# EasyEDA schematic SCH_v0.4_2021-05-04.json

## Sheets
1 CPU CORE: TITLE: CPU Core; REV: 0.2; Date: 2020-07-01; Sheet: 1/3; Drawn By: Renee; Company: Lost Cat Productions
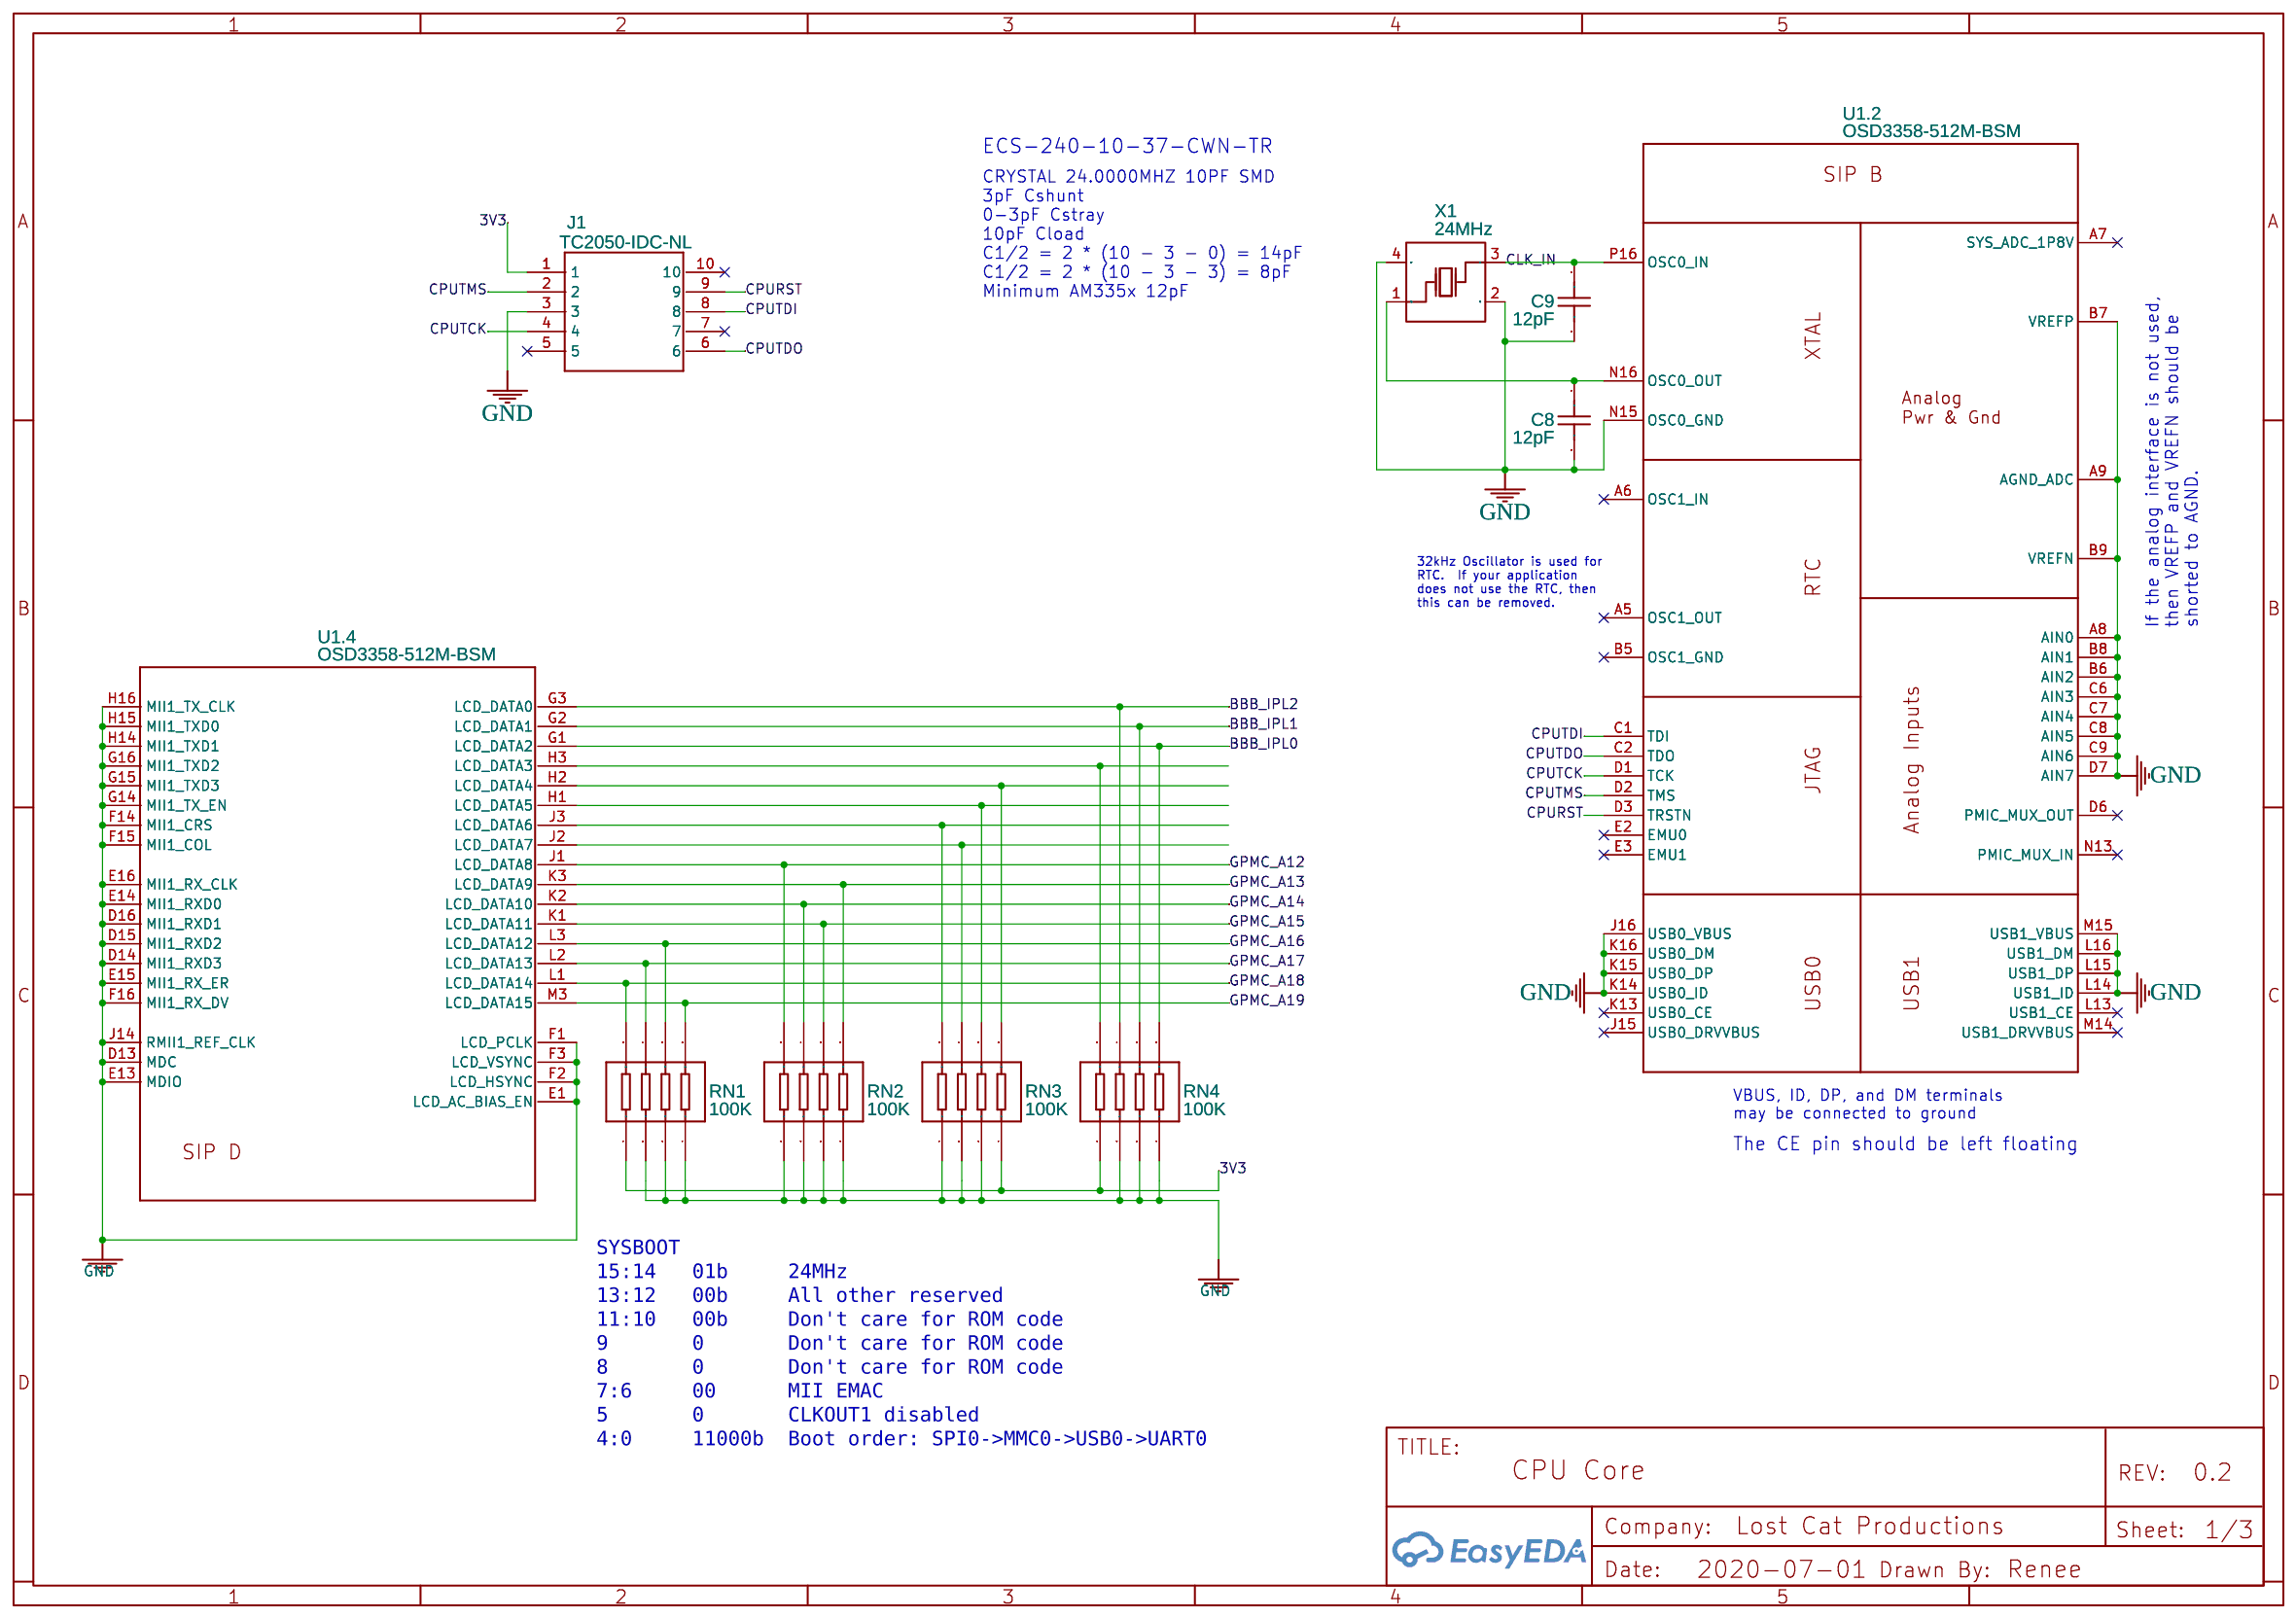
[diagram p0: CPU CORE]
2 CPU IO: TITLE: CPU Interface; Date: 2020-08-06; Sheet: 2/3
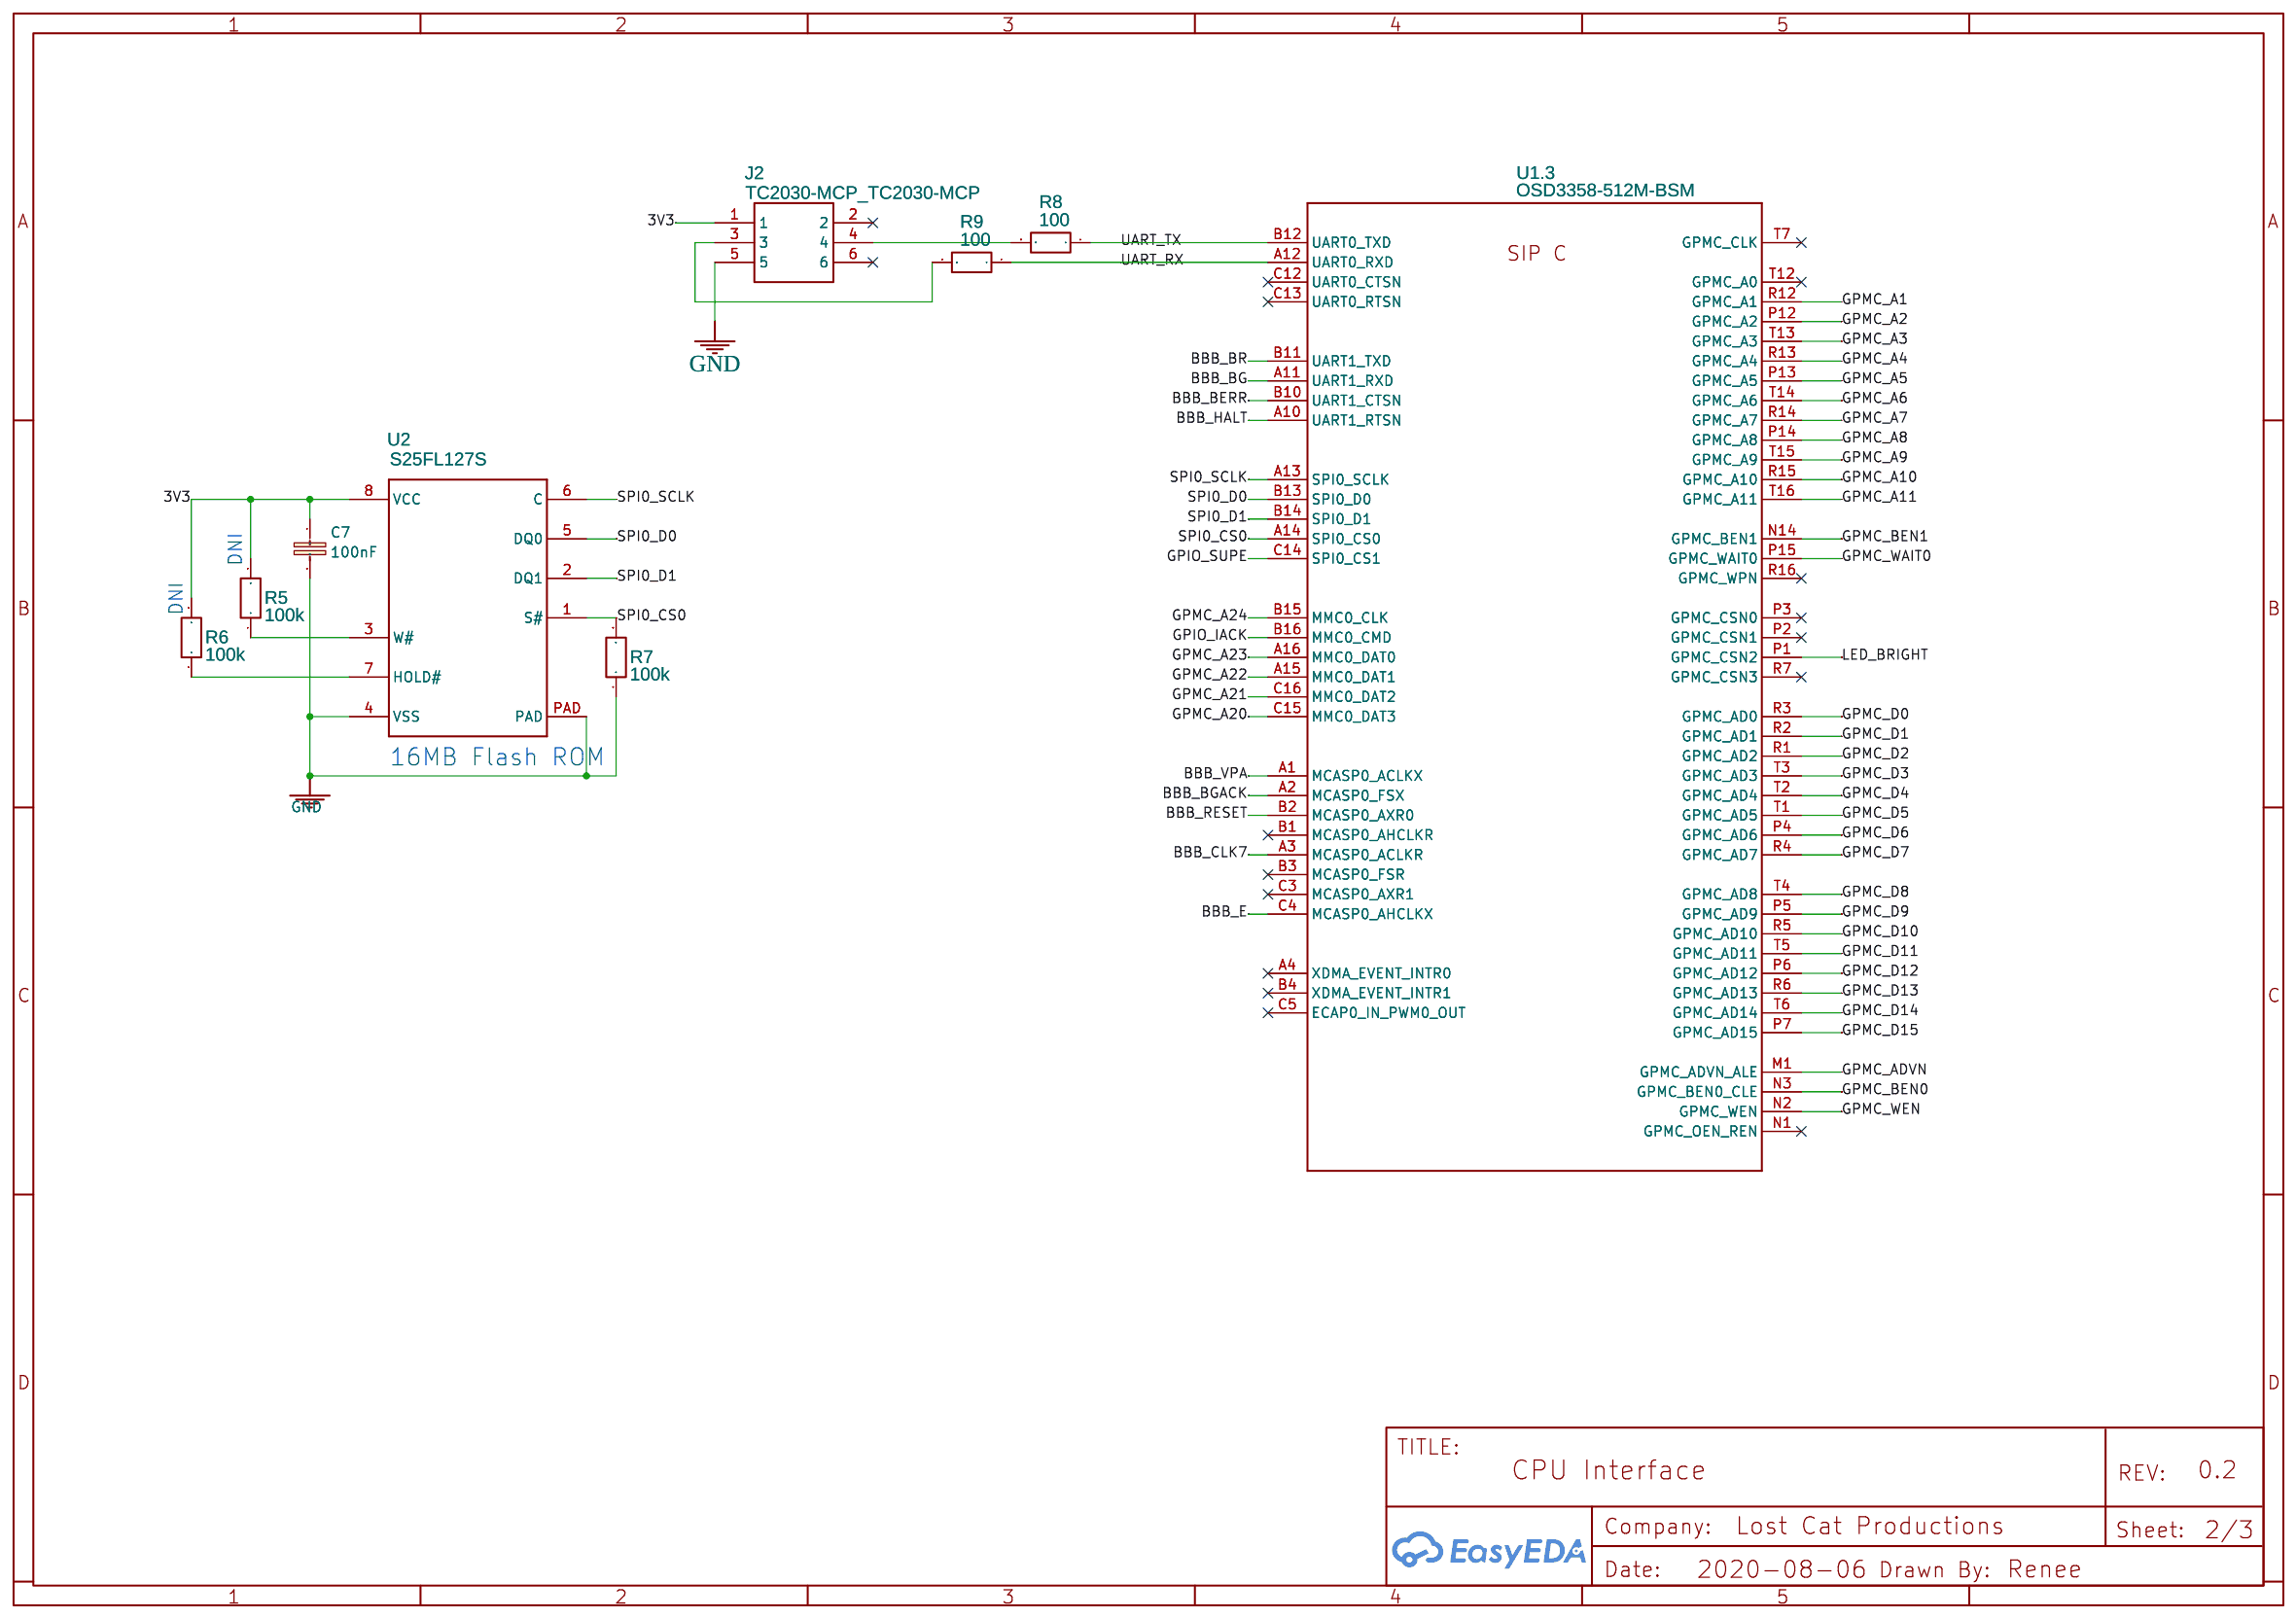
[diagram p1: CPU IO]
3 M68K IO: TITLE: M68K Interface; Sheet: 3/3
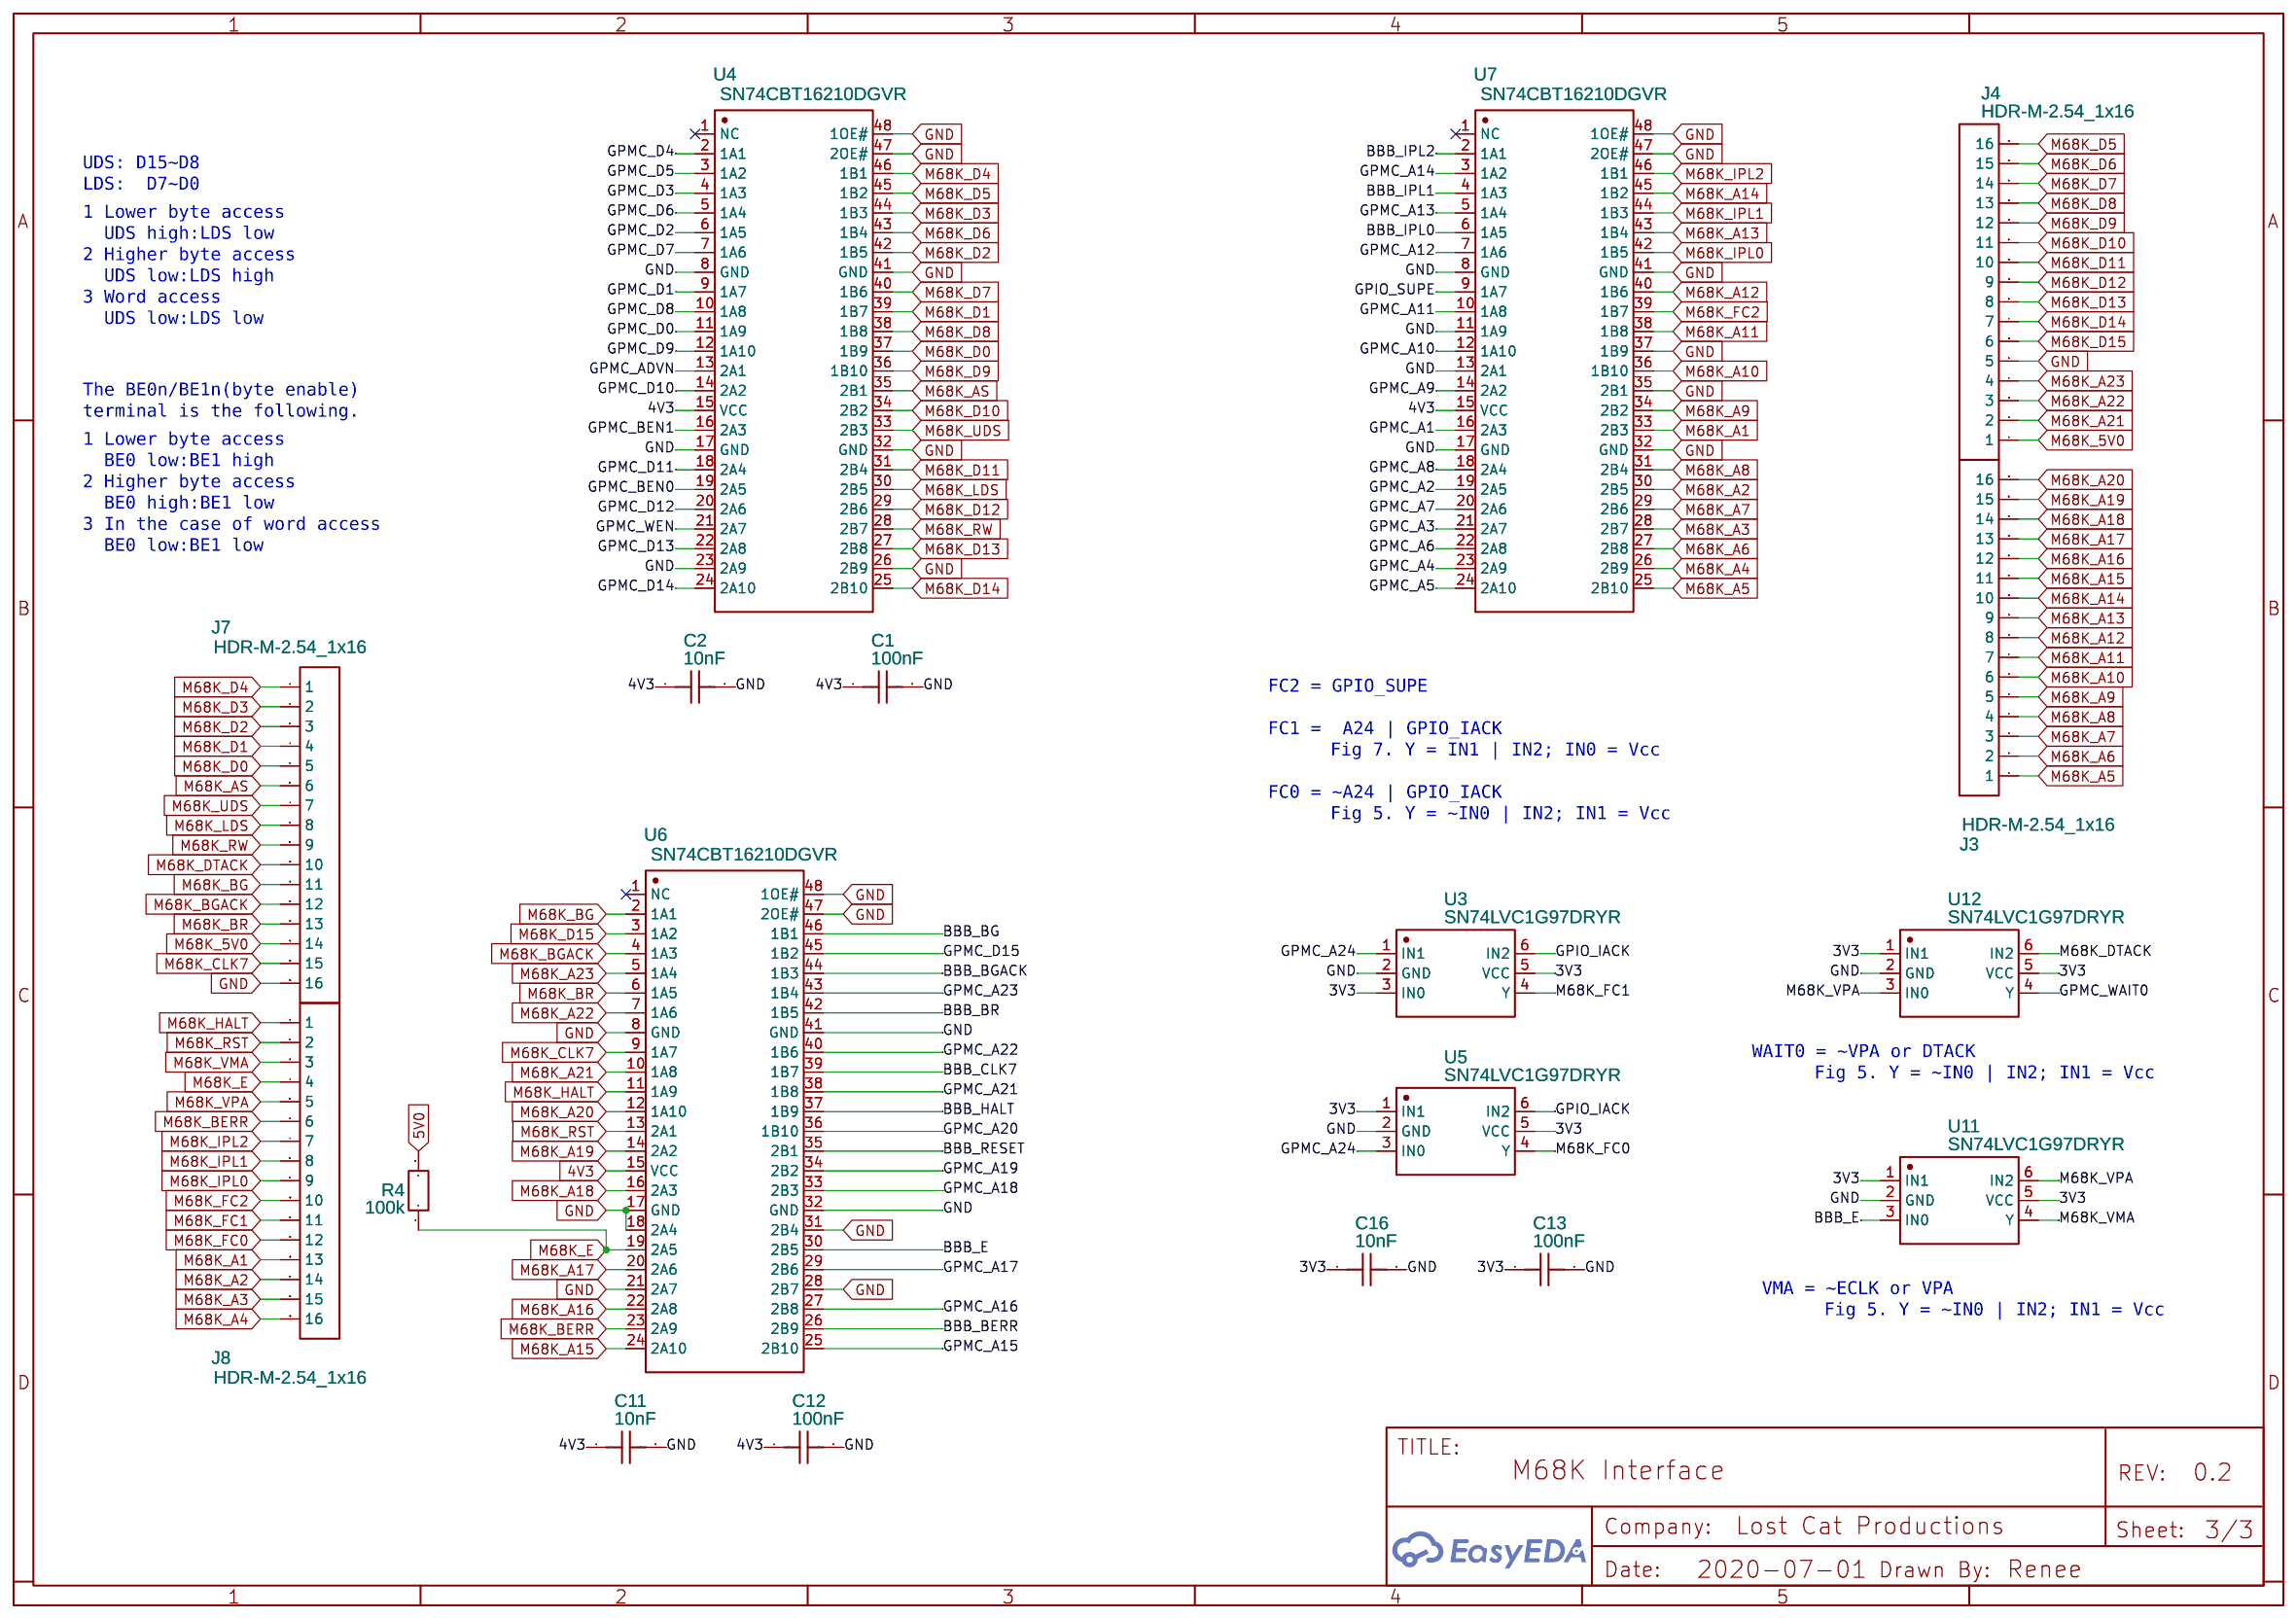
[diagram p2: M68K IO]
4 POWER: TITLE: Sheet_1; REV: 1.0; Date: 2021-02-09; Sheet: 1/1; Company: Your Company
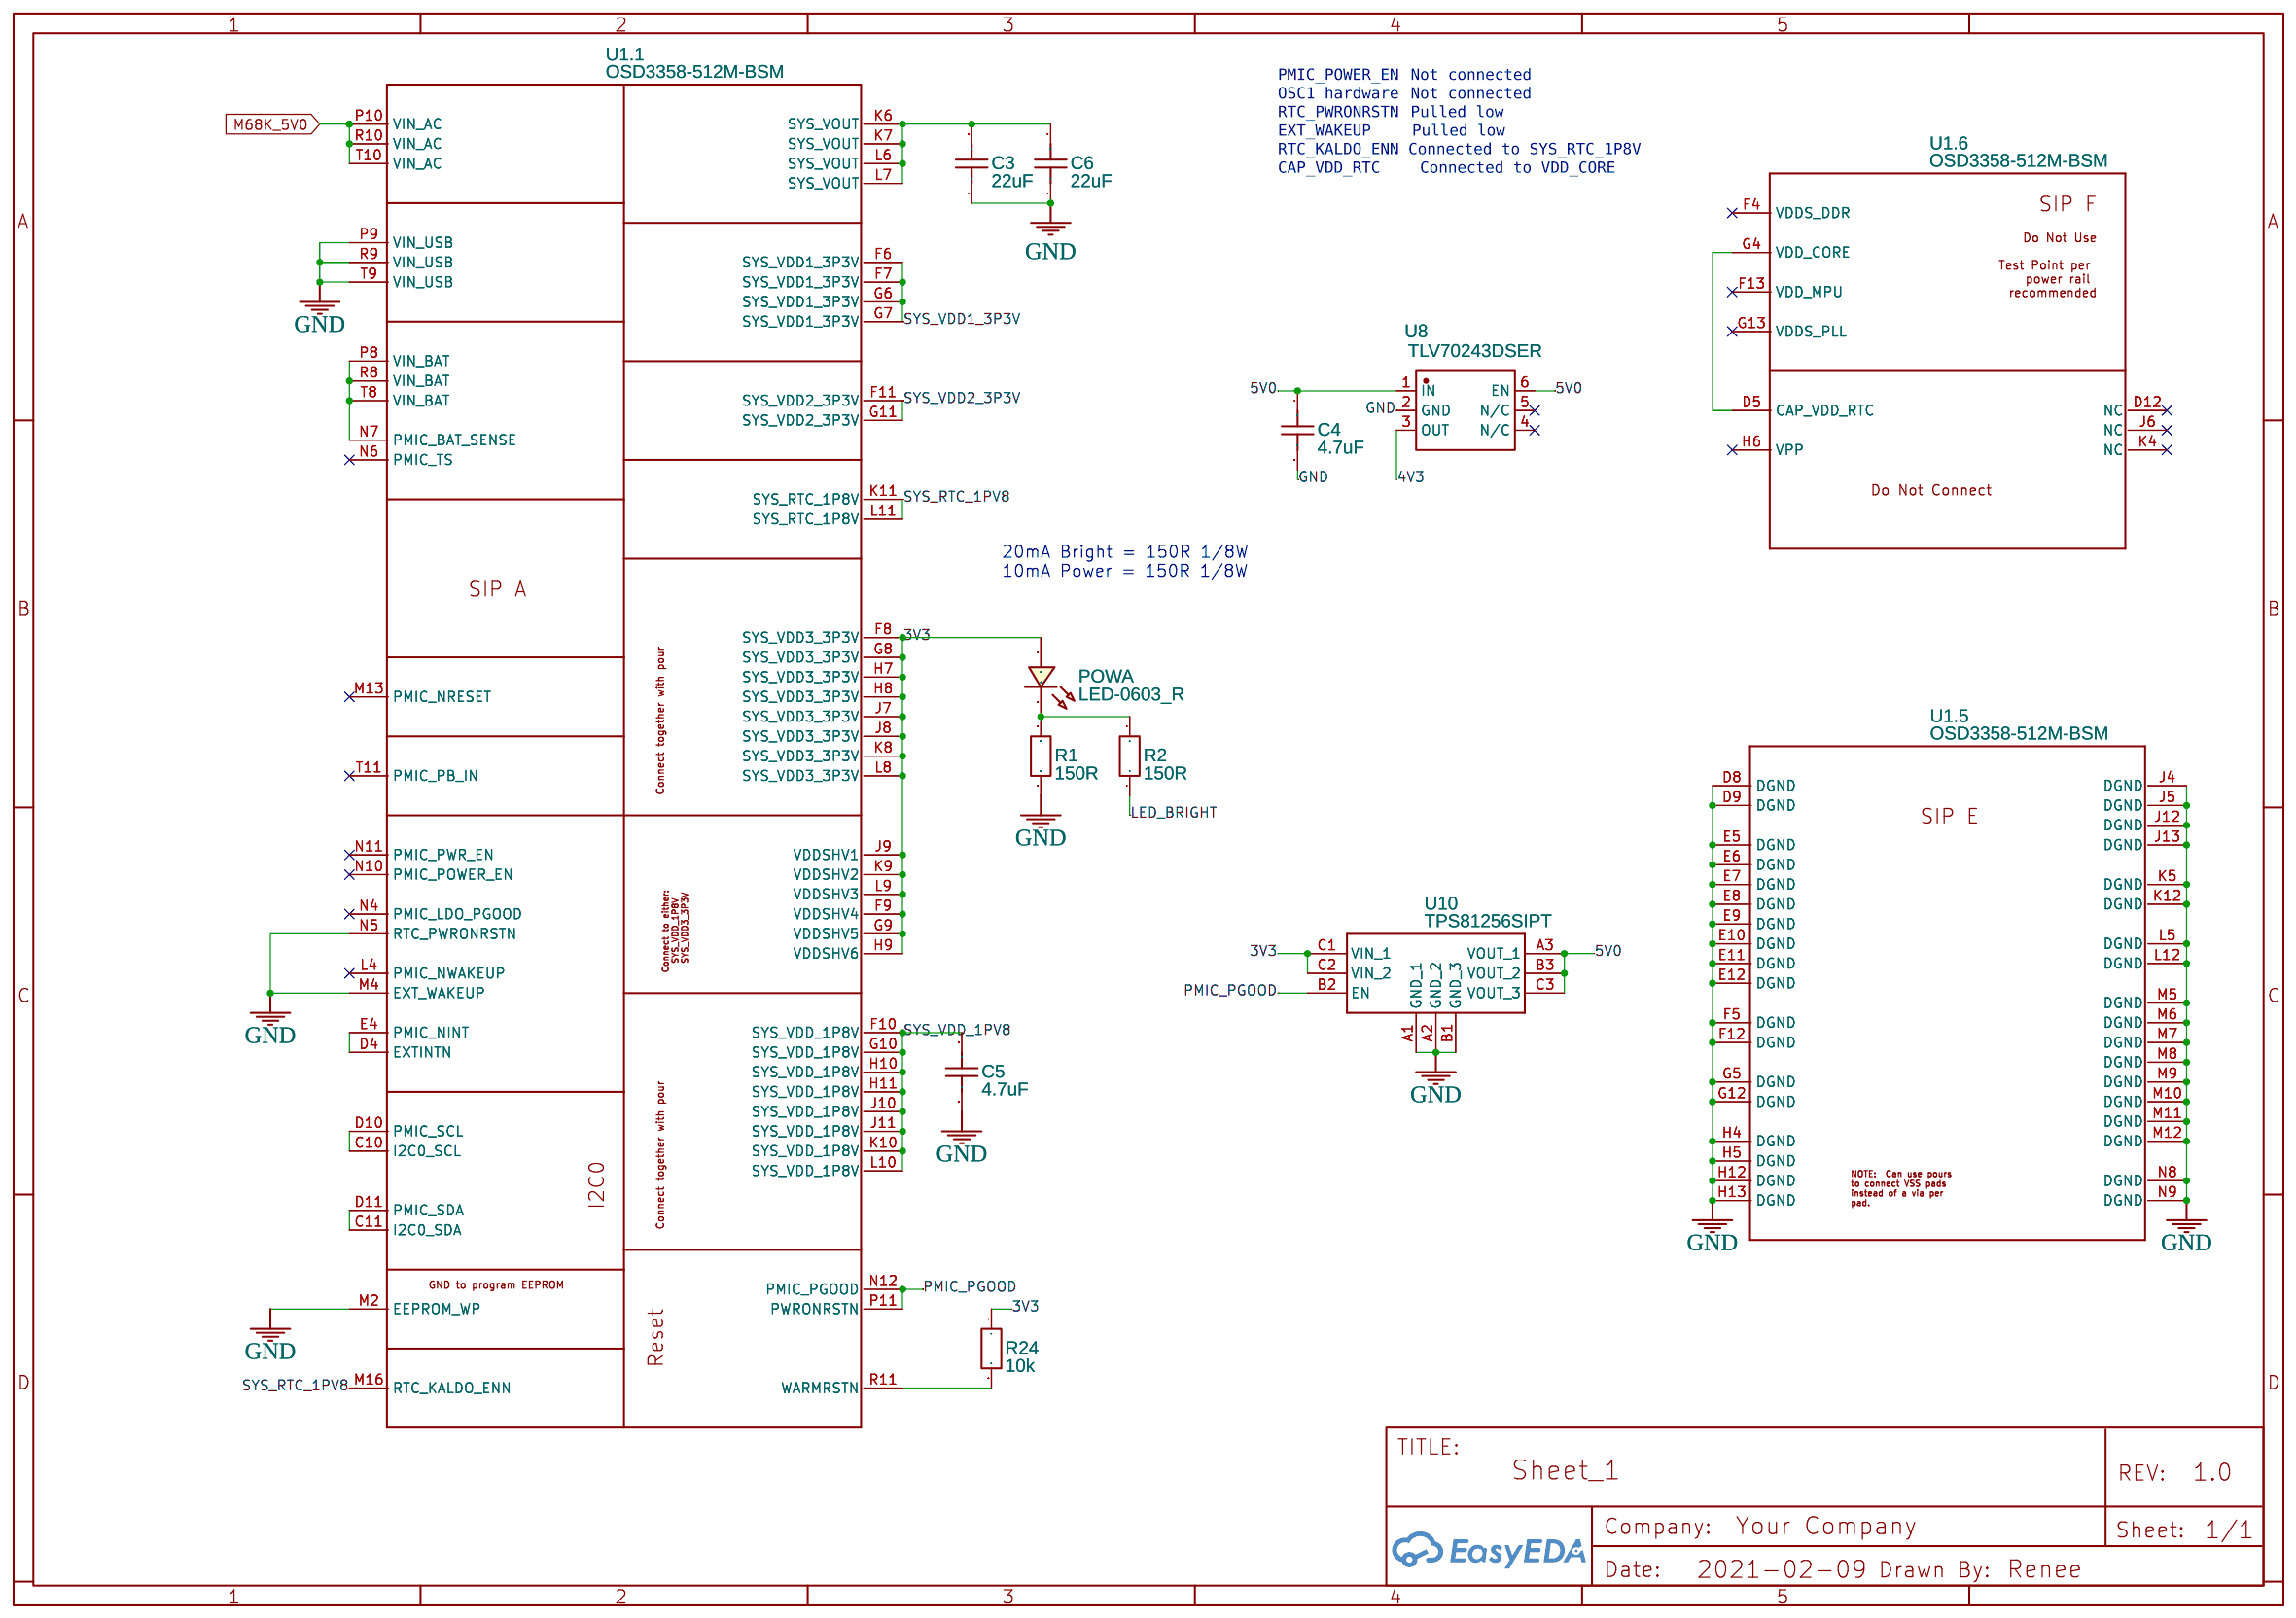
[diagram p3: POWER]

## Parts
sheet CPU CORE
C8  12pF  [C0402]
C9  12pF  [C0402]
J1  TC2050-IDC-NL  [TAG-CONNECT_TC2050-IDC-NL]
RN1  100K  [RES-ARRAY-SMD_0402-8P-L2.0-W1.0-BL]
RN2  100K  [RES-ARRAY-SMD_0402-8P-L2.0-W1.0-BL]
RN3  100K  [RES-ARRAY-SMD_0402-8P-L2.0-W1.0-BL]
RN4  100K  [RES-ARRAY-SMD_0402-8P-L2.0-W1.0-BL]
X1  24MHz  [OSC-SMD_4P-L2.0-W1.6-BL]
sheet CPU IO
C7  100nF  [C0402]
J2  TC2030-MCP_TC2030-MCP  [TAG-CONNECT_TC2030-IDC-NL]
R5  100k  [R0402]
R6  100k  [R0402]
R7  100k  [R0402]
R8  100  [R0402]
R9  100  [R0402]
U2  S25FL127S  [W-PDFN-8]
sheet M68K IO
C1  100nF  [C0402]
C2  10nF  [C0402]
C11  10nF  [C0402]
C12  100nF  [C0402]
C13  100nF  [C0402]
C16  10nF  [C0402]
J3  HDR-M-2.54_1x16  [HDR-M-2.54_1X16]
J4  HDR-M-2.54_1x16  [HDR-M-2.54_1X16]
J7  HDR-M-2.54_1x16  [HDR-M-2.54_1X16]
J8  HDR-M-2.54_1x16  [HDR-M-2.54_1X16]
R4  100k  [R0402]
U3  SN74LVC1G97DRYR  [SON-6_L1.5-W1.0-P0.50-BL]
U4  SN74CBT16210DGVR  [TVSOP-48_L9.8-W4.5-P0.40-LS6.4-BL]
U5  SN74LVC1G97DRYR  [SON-6_L1.5-W1.0-P0.50-BL]
U6  SN74CBT16210DGVR  [TVSOP-48_L9.8-W4.5-P0.40-LS6.4-BL]
U7  SN74CBT16210DGVR  [TVSOP-48_L9.8-W4.5-P0.40-LS6.4-BL]
U11  SN74LVC1G97DRYR  [SON-6_L1.5-W1.0-P0.50-BL]
U12  SN74LVC1G97DRYR  [SON-6_L1.5-W1.0-P0.50-BL]
sheet POWER
C3  22uF  [C0402]
C4  4.7uF  [C0402]
C5  4.7uF  [C0402]
C6  22uF  [C0402]
POWA  LED-0603_R  [LED0603_RED]
R1  150R  [R0805]
R2  150R  [R0805]
R24  10k  [R0402]
U1  OSD3358-512M-BSM  [OSD335X-BGA-256]  (sections 1,2,3,4,5,6)
U8  TLV70243DSER  [WSON-6_L1.5-W1.5-P0.50-TL]
U10  TPS81256SIPT  [BGA9C100P3X3_292X258X100]

## Library data of the parts
C8 C9 = C_0201_US: Supplier Part: C307443; Supplier: LCSC; Contributor: LCEDA_Lib; Manufacturer Part: CL05C180JB5NNNC; Manufacturer: Samsung Electro-Mechanics
J1 = TC2050-IDC-NL: Contributor: Joar Gjersund
RN1-RN4 = 4D02WGJ0104TCE: Supplier: LCSC; Manufacturer: UniOhm; Supplier Part: C25724; SMT Type: Extend; JLCPCB SMD: Yes; LCSC Assembly: Yes
X1 = ECS-240-10-37-CWN-TR: Supplier: LCSC; Supplier Part: C435198; Manufacturer: ECS; Contributor: LCSC
C7 = -: Supplier: LCSC; Manufacturer: SAMSUNG; Manufacturer Part: CL05B104KO5NNNC; Supplier Part: C1525
J2 = TC2030-MCP_TC2030-MCP: Contributor: Robert Chen
R4-R9 = R_0201_EU: Supplier Part: C25741; Supplier: LCSC; Contributor: LCEDA_Lib; Manufacturer Part: 0402WGF1003TCE; Manufacturer: UniOhm
U2 = S25FL127S: Contributor: Renee; Manufacturer Part: S25FL127SABMFI103; Supplier: LCSC; Manufacturer: Cypress Semicon; Supplier Part: C511143
C1 C2 C4 C5 C11-C13 C16 = C_0402_US: Supplier Part: C1525; Supplier: LCSC; Contributor: LCEDA_Lib; Manufacturer Part: CL05B104KO5NNNC; Manufacturer: SAMSUNG
J3 J4 J7 J8 = HDR-M-2.54_1x16: Supplier Part: C50981; Supplier: LCSC; Contributor: LCEDA_Lib
U3 U5 U11 U12 = SN74LVC1G97DRYR: Supplier: LCSC; Manufacturer: TI; Supplier Part: C133546
U4 U6 U7 = SN74CBT16210DLRG4: Supplier: LCSC; Manufacturer: TI; Package Display: No
C3 C6 = C_0805_US: Supplier Part: C16780; Supplier: LCSC; Contributor: LCEDA_Lib; Manufacturer Part: CL21A476MQYNNNE; Manufacturer: SAMSUNG
POWA = LED-0603_R: Manufacturer: EVERLIGHT(台湾亿光); Manufacturer Part: 19-217/R6C-AL1M2VY/3T; Supplier Part: C72044; Supplier: LCSC; Contributor: LCEDA_01
R1 R2 = R_0402_EU: Contributor: LCEDA_Lib
R24 = R_0201_EU: Supplier Part: C98838; Supplier: LCSC; Contributor: LCEDA_Lib; Manufacturer Part: TC0225F1002TCE; Manufacturer: UniOhm
U1 = OSD3358-512M-BSM: Contributor: Renee; subpart_no: 1
U8 = TLV70243DSER
U10 = TPS81256SIPT: Contributor: LFK84

## Nets
3V3: C7.1 C13.1 C16.1 J1.1 J2.1 POWA.1 R5.2 R6.2 R24.1 RN1.1 RN3.4 RN4.1 U1.F8(SYS_VDD3_3P3V) U1.F9(VDDSHV4) U1.G8(SYS_VDD3_3P3V) U1.G9(VDDSHV5) U1.H7(SYS_VDD3_3P3V) U1.H8(SYS_VDD3_3P3V) U1.H9(VDDSHV6) U1.J7(SYS_VDD3_3P3V) U1.J8(SYS_VDD3_3P3V) U1.J9(VDDSHV1) U1.K8(SYS_VDD3_3P3V) U1.K9(VDDSHV2) U1.L8(SYS_VDD3_3P3V) U1.L9(VDDSHV3) U2.8(VCC) U3.3(IN0) U3.5(VCC) U5.1(IN1) U5.5(VCC) U10.C1(VIN_1) U10.C2(VIN_2) U11.1(IN1) U11.5(VCC) U12.1(IN1) U12.5(VCC)
4V3: C1.1 C2.1 C11.1 C12.1 U4.15(VCC) U6.15(VCC) U7.15(VCC) U8.3(OUT)
5V0: C4.1 R4.2 U8.1(IN) U8.6(EN) U10.A3(VOUT_1) U10.B3(VOUT_2) U10.C3(VOUT_3)
GND: C1.2 C2.2 C3.1 C4.2 C5.2 C6.1 C7.2 C8.2 C9.2 C11.2 C12.2 C13.2 C16.2 J1.3 J2.5 J4.5 J7.16 R1.1 R7.1 RN1.2 RN1.3 RN1.4 RN2.1 RN2.2 RN2.3 RN2.4 RN3.1 RN3.2 RN3.3 RN4.2 RN4.3 RN4.4 U1.A8(AIN0) U1.A9(AGND_ADC) U1.B6(AIN2) U1.B7(VREFP) U1.B8(AIN1) U1.B9(VREFN) U1.C6(AIN3) U1.C7(AIN4) U1.C8(AIN5) U1.C9(AIN6) U1.D7(AIN7) U1.D8(DGND) U1.D9(DGND) U1.D13(MDC) U1.D14(MII1_RXD3) U1.D15(MII1_RXD2) U1.D16(MII1_RXD1) U1.E1(LCD_AC_BIAS_EN) U1.E5(DGND) U1.E6(DGND) U1.E7(DGND) U1.E8(DGND) U1.E9(DGND) U1.E10(DGND) U1.E11(DGND) U1.E12(DGND) U1.E13(MDIO) U1.E14(MII1_RXD0) U1.E15(MII1_RX_ER) U1.E16(MII1_RX_CLK) U1.F1(LCD_PCLK) U1.F2(LCD_HSYNC) U1.F3(LCD_VSYNC) U1.F5(DGND) U1.F12(DGND) U1.F14(MII1_CRS) U1.F15(MII1_COL) U1.F16(MII1_RX_DV) U1.G5(DGND) U1.G12(DGND) U1.G14(MII1_TX_EN) U1.G15(MII1_TXD3) U1.G16(MII1_TXD2) U1.H4(DGND) U1.H5(DGND) U1.H12(DGND) U1.H13(DGND) U1.H14(MII1_TXD1) U1.H15(MII1_TXD0) U1.H16(MII1_TX_CLK) U1.J4(DGND) U1.J5(DGND) U1.J12(DGND) U1.J13(DGND) U1.J14(RMII1_REF_CLK) U1.J16(USB0_VBUS) U1.K5(DGND) U1.K12(DGND) U1.K14(USB0_ID) U1.K15(USB0_DP) U1.K16(USB0_DM) U1.L5(DGND) U1.L12(DGND) U1.L14(USB1_ID) U1.L15(USB1_DP) U1.L16(USB1_DM) U1.M2(EEPROM_WP) U1.M4(EXT_WAKEUP) U1.M5(DGND) U1.M6(DGND) U1.M7(DGND) U1.M8(DGND) U1.M9(DGND) U1.M10(DGND) U1.M11(DGND) U1.M12(DGND) U1.M15(USB1_VBUS) U1.N5(RTC_PWRONRSTN) U1.N8(DGND) U1.N9(DGND) U1.N15(OSC0_GND) U1.P9(VIN_USB) U1.R9(VIN_USB) U1.T9(VIN_USB) U2.4(VSS) U2.PAD U3.2(GND) U4.8(GND) U4.17(GND) U4.23(2A9) U4.26(2B9) U4.32(GND) U4.41(GND) U4.47(2OE#) U4.48(1OE#) U5.2(GND) U6.8(GND) U6.17(GND) U6.18(2A4) U6.21(2A7) U6.28(2B7) U6.31(2B4) U6.32(GND) U6.41(GND) U6.47(2OE#) U6.48(1OE#) U7.8(GND) U7.11(1A9) U7.13(2A1) U7.17(GND) U7.32(GND) U7.35(2B1) U7.37(1B9) U7.41(GND) U7.47(2OE#) U7.48(1OE#) U8.2(GND) U10.A1(GND_1) U10.A2(GND_2) U10.B1(GND_3) U11.2(GND) U12.2(GND) X1.2(GND) X1.4(GND)
BBB_BERR: U1.B10(UART1_CTSN) U6.26(2B9)
BBB_BG: U1.A11(UART1_RXD) U6.46(1B1)
BBB_BGACK: U1.A2(MCASP0_FSX) U6.44(1B3)
BBB_BR: U1.B11(UART1_TXD) U6.42(1B5)
BBB_CLK7: U1.A3(MCASP0_ACLKR) U6.39(1B7)
BBB_E: U1.C4(MCASP0_AHCLKX) U6.30(2B5) U11.3(IN0)
BBB_HALT: U1.A10(UART1_RTSN) U6.37(1B9)
BBB_IPL0: RN4.5 U1.G1(LCD_DATA2) U7.6(1A5)
BBB_IPL1: RN4.6 U1.G2(LCD_DATA1) U7.4(1A3)
BBB_IPL2: RN4.7 U1.G3(LCD_DATA0) U7.2(1A1)
BBB_RESET: U1.B2(MCASP0_AXR0) U6.35(2B1)
BBB_VPA: U1.A1(MCASP0_ACLKX)
CLK_IN: C9.1 U1.P16(OSC0_IN) X1.3(OSC2)
CPURST: J1.9 U1.D3(TRSTN)
CPUTCK: J1.4 U1.D1(TCK)
CPUTDI: J1.8 U1.C1(TDI)
CPUTDO: J1.6 U1.C2(TDO)
CPUTMS: J1.2 U1.D2(TMS)
GPIO_IACK: U1.B16(MMC0_CMD) U3.6(IN2) U5.6(IN2)
GPIO_SUPE: U1.C14(SPI0_CS1) U7.9(1A7)
GPMC_A1: U1.R12(GPMC_A1) U7.16(2A3)
GPMC_A2: U1.P12(GPMC_A2) U7.19(2A5)
GPMC_A3: U1.T13(GPMC_A3) U7.21(2A7)
GPMC_A4: U1.R13(GPMC_A4) U7.23(2A9)
GPMC_A5: U1.P13(GPMC_A5) U7.24(2A10)
GPMC_A6: U1.T14(GPMC_A6) U7.22(2A8)
GPMC_A7: U1.R14(GPMC_A7) U7.20(2A6)
GPMC_A8: U1.P14(GPMC_A8) U7.18(2A4)
GPMC_A9: U1.T15(GPMC_A9) U7.14(2A2)
GPMC_A10: U1.R15(GPMC_A10) U7.12(1A10)
GPMC_A11: U1.T16(GPMC_A11) U7.10(1A8)
GPMC_A12: RN2.8 U1.J1(LCD_DATA8) U7.7(1A6)
GPMC_A13: RN2.5 U1.K3(LCD_DATA9) U7.5(1A4)
GPMC_A14: RN2.7 U1.K2(LCD_DATA10) U7.3(1A2)
GPMC_A15: RN2.6 U1.K1(LCD_DATA11) U6.25(2B10)
GPMC_A16: RN1.6 U1.L3(LCD_DATA12) U6.27(2B8)
GPMC_A17: RN1.7 U1.L2(LCD_DATA13) U6.29(2B6)
GPMC_A18: RN1.8 U1.L1(LCD_DATA14) U6.33(2B3)
GPMC_A19: RN1.5 U1.M3(LCD_DATA15) U6.34(2B2)
GPMC_A20: U1.C15(MMC0_DAT3) U6.36(1B10)
GPMC_A21: U1.C16(MMC0_DAT2) U6.38(1B8)
GPMC_A22: U1.A15(MMC0_DAT1) U6.40(1B6)
GPMC_A23: U1.A16(MMC0_DAT0) U6.43(1B4)
GPMC_A24: U1.B15(MMC0_CLK) U3.1(IN1) U5.3(IN0)
GPMC_ADVN: U1.M1(GPMC_ADVN_ALE) U4.13(2A1)
GPMC_BEN0: U1.N3(GPMC_BEN0_CLE) U4.19(2A5)
GPMC_BEN1: U1.N14(GPMC_BEN1) U4.16(2A3)
GPMC_D0: U1.R3(GPMC_AD0) U4.11(1A9)
GPMC_D1: U1.R2(GPMC_AD1) U4.9(1A7)
GPMC_D2: U1.R1(GPMC_AD2) U4.6(1A5)
GPMC_D3: U1.T3(GPMC_AD3) U4.4(1A3)
GPMC_D4: U1.T2(GPMC_AD4) U4.2(1A1)
GPMC_D5: U1.T1(GPMC_AD5) U4.3(1A2)
GPMC_D6: U1.P4(GPMC_AD6) U4.5(1A4)
GPMC_D7: U1.R4(GPMC_AD7) U4.7(1A6)
GPMC_D8: U1.T4(GPMC_AD8) U4.10(1A8)
GPMC_D9: U1.P5(GPMC_AD9) U4.12(1A10)
GPMC_D10: U1.R5(GPMC_AD10) U4.14(2A2)
GPMC_D11: U1.T5(GPMC_AD11) U4.18(2A4)
GPMC_D12: U1.P6(GPMC_AD12) U4.20(2A6)
GPMC_D13: U1.R6(GPMC_AD13) U4.22(2A8)
GPMC_D14: U1.T6(GPMC_AD14) U4.24(2A10)
GPMC_D15: U1.P7(GPMC_AD15) U6.45(1B2)
GPMC_WAIT0: U1.P15(GPMC_WAIT0) U12.4(Y)
GPMC_WEN: U1.N2(GPMC_WEN) U4.21(2A7)
LED_BRIGHT: R2.1 U1.P1(GPMC_CSN2)
M68K_5V0: J4.1 J7.14 U1.P10(VIN_AC) U1.R10(VIN_AC) U1.T10(VIN_AC)
M68K_A1: J8.13 U7.33(2B3)
M68K_A2: J8.14 U7.30(2B5)
M68K_A3: J8.15 U7.28(2B7)
M68K_A4: J8.16 U7.26(2B9)
M68K_A5: J3.1 U7.25(2B10)
M68K_A6: J3.2 U7.27(2B8)
M68K_A7: J3.3 U7.29(2B6)
M68K_A8: J3.4 U7.31(2B4)
M68K_A9: J3.5 U7.34(2B2)
M68K_A10: J3.6 U7.36(1B10)
M68K_A11: J3.7 U7.38(1B8)
M68K_A12: J3.8 U7.40(1B6)
M68K_A13: J3.9 U7.43(1B4)
M68K_A14: J3.10 U7.45(1B2)
M68K_A15: J3.11 U6.24(2A10)
M68K_A16: J3.12 U6.22(2A8)
M68K_A17: J3.13 U6.20(2A6)
M68K_A18: J3.14 U6.16(2A3)
M68K_A19: J3.15 U6.14(2A2)
M68K_A20: J3.16 U6.12(1A10)
M68K_A21: J4.2 U6.10(1A8)
M68K_A22: J4.3 U6.7(1A6)
M68K_A23: J4.4 U6.5(1A4)
M68K_AS: J7.6 U4.35(2B1)
M68K_BERR: J8.6 U6.23(2A9)
M68K_BG: J7.11 U6.2(1A1)
M68K_BGACK: J7.12 U6.4(1A3)
M68K_BR: J7.13 U6.6(1A5)
M68K_CLK7: J7.15 U6.9(1A7)
M68K_D0: J7.5 U4.37(1B9)
M68K_D1: J7.4 U4.39(1B7)
M68K_D2: J7.3 U4.42(1B5)
M68K_D3: J7.2 U4.44(1B3)
M68K_D4: J7.1 U4.46(1B1)
M68K_D5: J4.16 U4.45(1B2)
M68K_D6: J4.15 U4.43(1B4)
M68K_D7: J4.14 U4.40(1B6)
M68K_D8: J4.13 U4.38(1B8)
M68K_D9: J4.12 U4.36(1B10)
M68K_D10: J4.11 U4.34(2B2)
M68K_D11: J4.10 U4.31(2B4)
M68K_D12: J4.9 U4.29(2B6)
M68K_D13: J4.8 U4.27(2B8)
M68K_D14: J4.7 U4.25(2B10)
M68K_D15: J4.6 U6.3(1A2)
M68K_DTACK: J7.10 U12.6(IN2)
M68K_E: J8.4 R4.1 U6.19(2A5)
M68K_FC0: J8.12 U5.4(Y)
M68K_FC1: J8.11 U3.4(Y)
M68K_FC2: J8.10 U7.39(1B7)
M68K_HALT: J8.1 U6.11(1A9)
M68K_IPL0: J8.9 U7.42(1B5)
M68K_IPL1: J8.8 U7.44(1B3)
M68K_IPL2: J8.7 U7.46(1B1)
M68K_LDS: J7.8 U4.30(2B5)
M68K_RST: J8.2 U6.13(2A1)
M68K_RW: J7.9 U4.28(2B7)
M68K_UDS: J7.7 U4.33(2B3)
M68K_VMA: J8.3 U11.4(Y)
M68K_VPA: J8.5 U11.6(IN2) U12.3(IN0)
PMIC_PGOOD: U1.N12(PMIC_PGOOD) U1.P11(PWRONRSTN) U10.B2(EN)
SPI0_CS0: R7.2 U1.A14(SPI0_CS0) U2.1(S#)
SPI0_D0: U1.B13(SPI0_D0) U2.5(DQ0)
SPI0_D1: U1.B14(SPI0_D1) U2.2(DQ1)
SPI0_SCLK: U1.A13(SPI0_SCLK) U2.6(C)
SYS_RTC_1PV8: U1.K11(SYS_RTC_1P8V) U1.L11(SYS_RTC_1P8V) U1.M16(RTC_KALDO_ENN)
SYS_VDD1_3P3V: U1.F6(SYS_VDD1_3P3V) U1.F7(SYS_VDD1_3P3V) U1.G6(SYS_VDD1_3P3V) U1.G7(SYS_VDD1_3P3V)
SYS_VDD2_3P3V: U1.F11(SYS_VDD2_3P3V) U1.G11(SYS_VDD2_3P3V)
SYS_VDD_1PV8: C5.1 U1.F10(SYS_VDD_1P8V) U1.G10(SYS_VDD_1P8V) U1.H10(SYS_VDD_1P8V) U1.H11(SYS_VDD_1P8V) U1.J10(SYS_VDD_1P8V) U1.J11(SYS_VDD_1P8V) U1.K10(SYS_VDD_1P8V) U1.L10(SYS_VDD_1P8V)
UART_RX: R9.1 U1.A12(UART0_RXD)
UART_TX: R8.1 U1.B12(UART0_TXD)
Net-(C3-2): C3.2 C6.2 U1.K6(SYS_VOUT) U1.K7(SYS_VOUT) U1.L6(SYS_VOUT) U1.L7(SYS_VOUT)
Net-(C8-1): C8.1 U1.N16(OSC0_OUT) X1.1(OSC1)
Net-(J2-3): J2.3 R9.2
Net-(J2-4): J2.4 R8.2
Net-(POWA-2): POWA.2 R1.2 R2.2
Net-(R5-1): R5.1 U2.3(W#)
Net-(R6-1): R6.1 U2.7(HOLD#)
Net-(R24-2): R24.2 U1.R11(WARMRSTN)
Net-(RN3-5): RN3.5 U1.H2(LCD_DATA4)
Net-(RN3-6): RN3.6 U1.H1(LCD_DATA5)
Net-(RN3-7): RN3.7 U1.J2(LCD_DATA7)
Net-(RN3-8): RN3.8 U1.J3(LCD_DATA6)
Net-(RN4-8): RN4.8 U1.H3(LCD_DATA3)
Net-(U1.1-C10): U1.C10(I2C0_SCL) U1.D10(PMIC_SCL)
Net-(U1.1-C11): U1.C11(I2C0_SDA) U1.D11(PMIC_SDA)
Net-(U1.1-D4): U1.D4(EXTINTN) U1.E4(PMIC_NINT)
Net-(U1.1-N7): U1.N7(PMIC_BAT_SENSE) U1.P8(VIN_BAT) U1.R8(VIN_BAT) U1.T8(VIN_BAT)
Net-(U1.6-D5): U1.D5(CAP_VDD_RTC) U1.G4(VDD_CORE)

Not connected (* = marked no-connect by the designer): J1 5* 7* 10*; J2 2* 6*; U1 A4(XDMA_EVENT_INTR0)* A5(OSC1_OUT)* A6(OSC1_IN)* A7(SYS_ADC_1P8V)* B1(MCASP0_AHCLKR)* B3(MCASP0_FSR)* B4(XDMA_EVENT_INTR1)* B5(OSC1_GND)* C3(MCASP0_AXR1)* C5(ECAP0_IN_PWM0_OUT)* C12(UART0_CTSN)* C13(UART0_RTSN)* D6(PMIC_MUX_OUT)* D12(NC)* E2(EMU0)* E3(EMU1)* F4(VDDS_DDR)* F13(VDD_MPU)* G13(VDDS_PLL)* H6(VPP)* J6(NC)* J15(USB0_DRVVBUS)* K4(NC)* K13(USB0_CE)* L4(PMIC_NWAKEUP)* L13(USB1_CE)* M13(PMIC_NRESET)* M14(USB1_DRVVBUS)* N1(GPMC_OEN_REN)* N4(PMIC_LDO_PGOOD)* N6(PMIC_TS)* N10(PMIC_POWER_EN)* N11(PMIC_PWR_EN)* N13(PMIC_MUX_IN)* P2(GPMC_CSN1)* P3(GPMC_CSN0)* R7(GPMC_CSN3)* R16(GPMC_WPN)* T7(GPMC_CLK)* T11(PMIC_PB_IN)* T12(GPMC_A0)*; U4 1(NC)*; U6 1(NC)*; U7 1(NC)*; U8 4(N/C)* 5(N/C)*

## Notes on the sheets
sheet 1
- ECS-240-10-37-CWN-TR
- CRYSTAL 24.0000MHZ 10PF SMD
  3pF Cshunt
  0-3pF Cstray
  10pF Cload
  C1/2 = 2 * (10 - 3 - 0) = 14pF
  C1/2 = 2 * (10 - 3 - 3) = 8pF
  Minimum AM335x 12pF
- 32kHz Oscillator is used for
  RTC.  If your application
  does not use the RTC, then
  this can be removed.
- If the analog interface is not used,
  then VREFP and VREFN should be
  shorted to AGND.
- VBUS, ID, DP, and DM terminals
  may be connected to ground
- The CE pin should be left floating
- SYSBOOT
  15:14   01b     24MHz
  13:12   00b     All other reserved
  11:10   00b     Don't care for ROM code
  9       0       Don't care for ROM code
  8       0       Don't care for ROM code
  7:6     00      MII EMAC
  5       0       CLKOUT1 disabled
  4:0     11000b  Boot order: SPI0->MMC0->USB0->UART0
sheet 2
- DNI
- DNI
- 16MB Flash ROM
sheet 3
- UDS: D15~D8
  LDS:  D7~D0
- 1 Lower byte access
    UDS high:LDS low
  2 Higher byte access
    UDS low:LDS high
  3 Word access
    UDS low:LDS low
- The BE0n/BE1n(byte enable)
  terminal is the following.
- 1 Lower byte access
    BE0 low:BE1 high
  2 Higher byte access
    BE0 high:BE1 low
  3 In the case of word access
    BE0 low:BE1 low
- FC2 = GPIO_SUPE
  FC1 =  A24 | GPIO_IACK
  	   Fig 7. Y = IN1 | IN2; IN0 = Vcc
  FC0 = ~A24 | GPIO_IACK
  	   Fig 5. Y = ~IN0 | IN2; IN1 = Vcc
- WAIT0 = ~VPA or DTACK
  	   Fig 5. Y = ~IN0 | IN2; IN1 = Vcc
- VMA = ~ECLK or VPA
  	   Fig 5. Y = ~IN0 | IN2; IN1 = Vcc
sheet 4
- PMIC_POWER_EN	Not connected
  OSC1 hardware	Not connected
  RTC_PWRONRSTN	Pulled low
  EXT_WAKEUP	   Pulled low
  RTC_KALDO_ENN Connected to SYS_RTC_1P8V
  CAP_VDD_RTC 	 Connected to VDD_CORE
- 20mA Bright = 150R 1/8W
  10mA Power = 150R 1/8W
